# Altium project TIDA-010086_mod.PrjPcb (part 6 of 11)

## Sheet XTIDA-010086_ADC.SchDoc
size 558 x 431 mm; Date: Not shown in title block; ApprovedBy: Not shown in title block; CheckedBy: Not shown in title block; Author: Not shown in title block; CompanyName: Not shown in title block; Engineer: Not shown in title block; Organization: Not shown in title block; Address1: Not shown in title block; Address2: Not shown in title block; Address3: Not shown in title block; Address4: Not shown in title block; DocumentNumber: 2; Revision: Use project parameter SCH_Rev; SheetNumber: 5; SheetTotal: 8; PageSetup: Record=PageOptions|CenterHorizontal=True|CenterVertical=True|PrintScale=1.00|XCorrection=1.00|YCorrection=1.00|PrintKind=0|BorderSize=5000000|LeftOffset=0|BottomOffset=0|Orientation=2|PaperLength=1000|PaperWidth=1000|Scale=100|PaperSource=15|PrintQuality=600|MediaType=1|DitherType=10|PaperKind=Letter|PrintScaleMode=1; CurrentTime: Not shown in title block; CurrentDate: Not shown in title block; Time: Not shown in title block; DocumentFullPathAndName: Not shown in title block; DocumentName: Not shown in title block; ModifiedDate: Not shown in title block; ImagePath: Not shown in title block
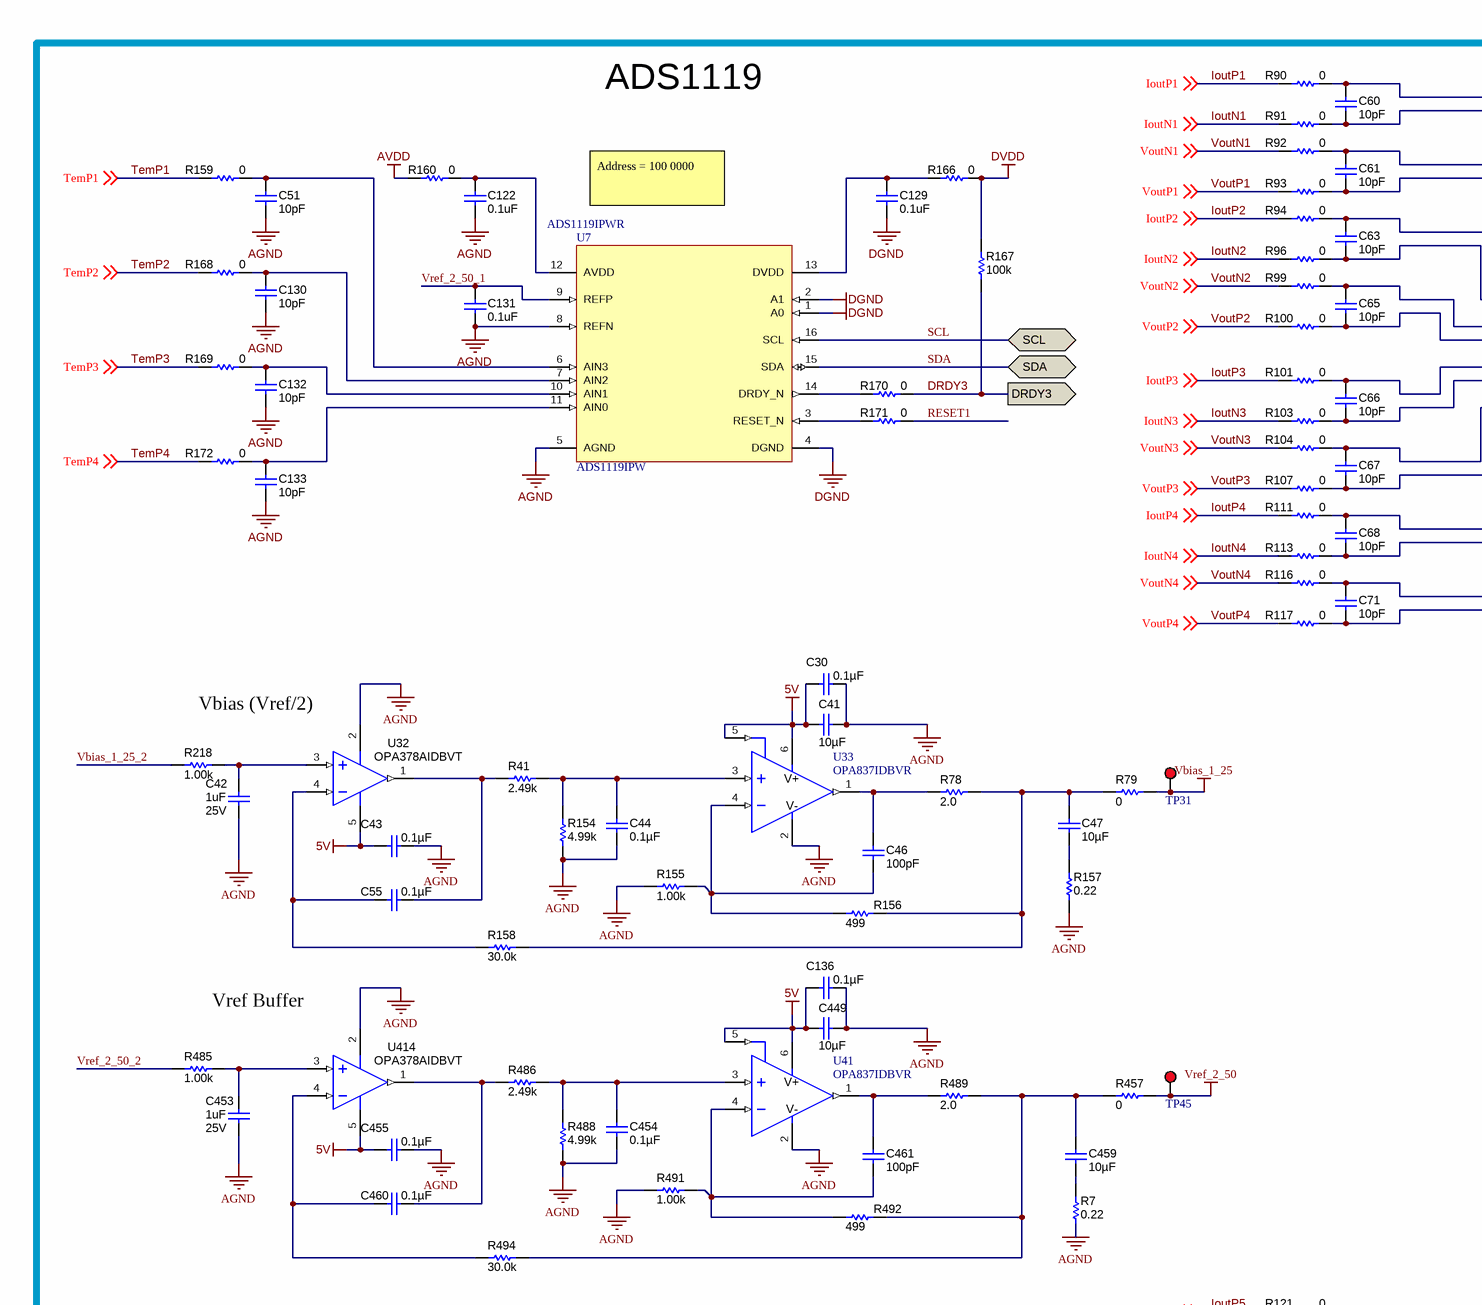
[diagram p9: XTIDA-010086_ADC.SchDoc, top left]
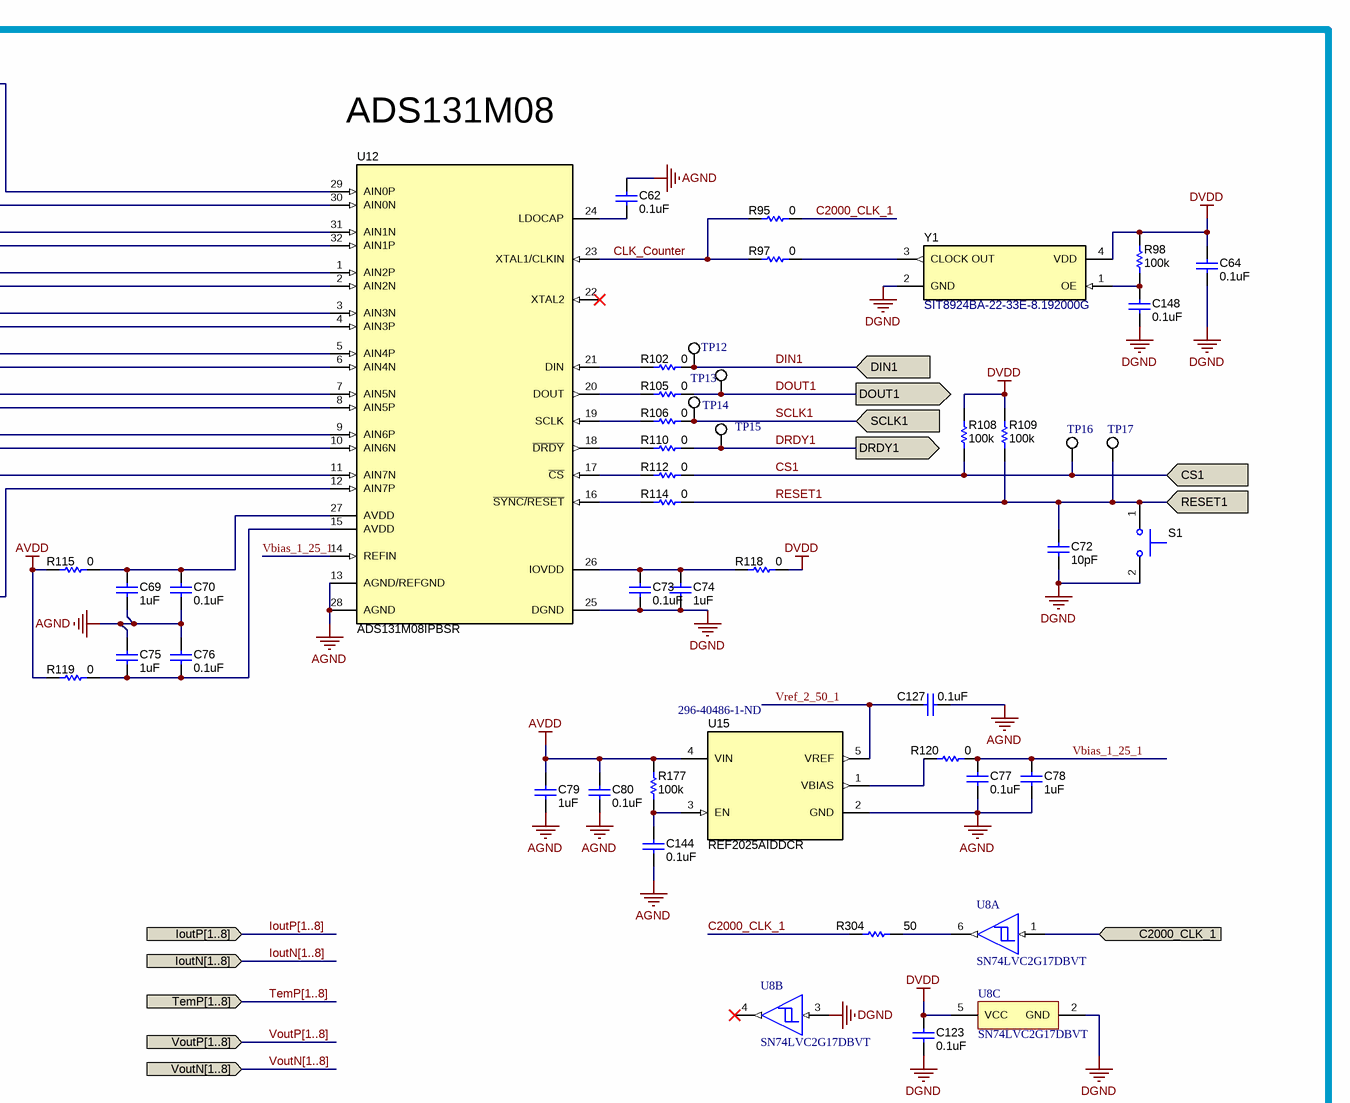
[diagram p10: XTIDA-010086_ADC.SchDoc, top right]
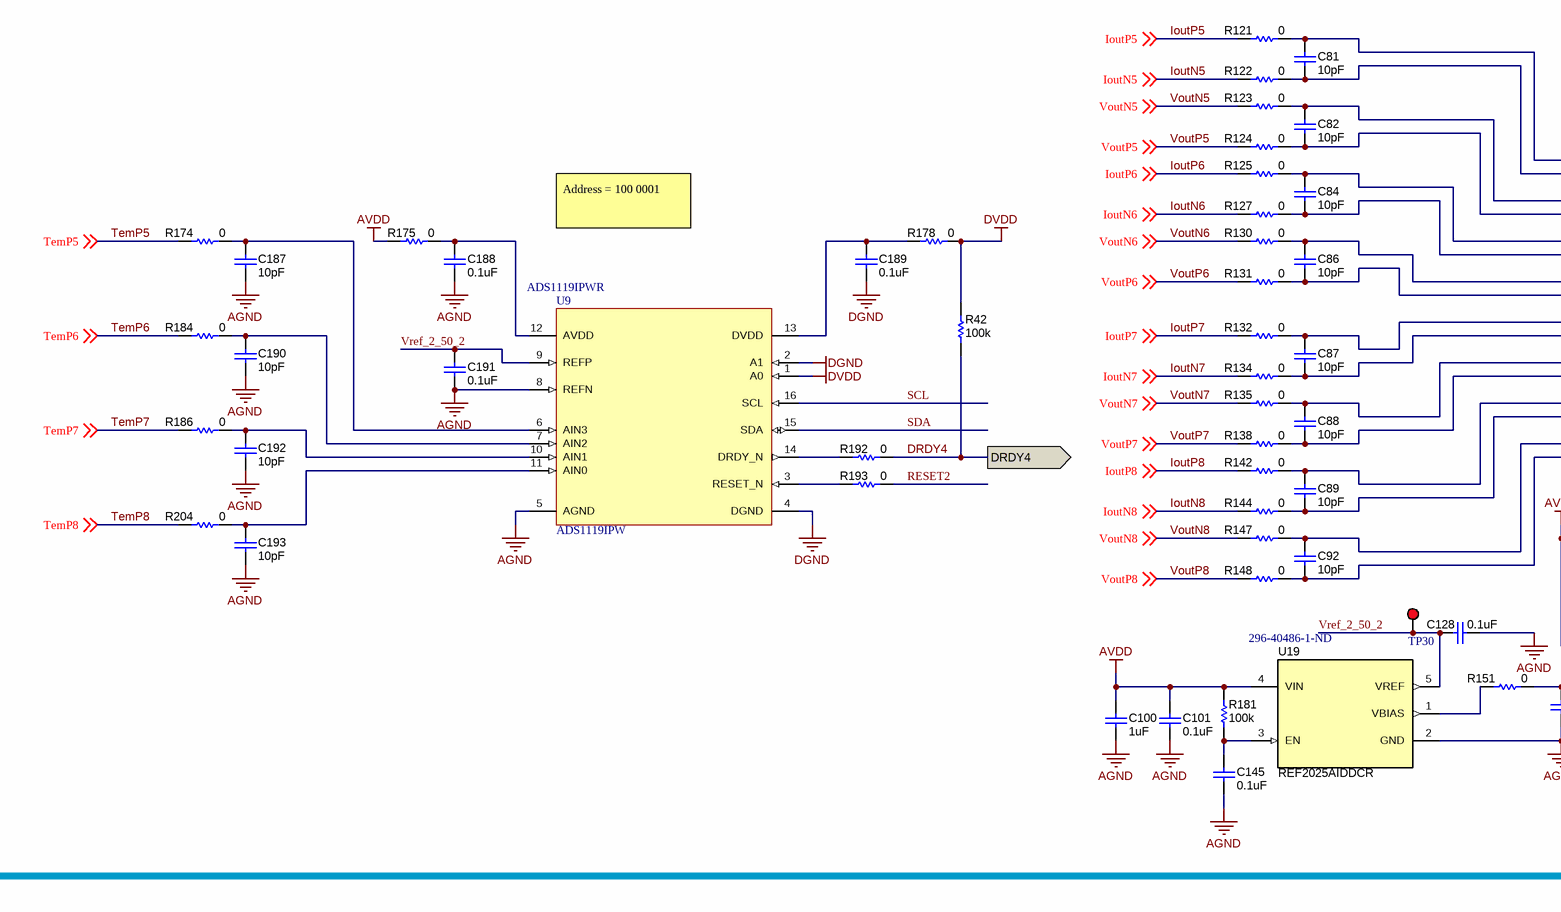
[diagram p11: XTIDA-010086_ADC.SchDoc, bottom left]
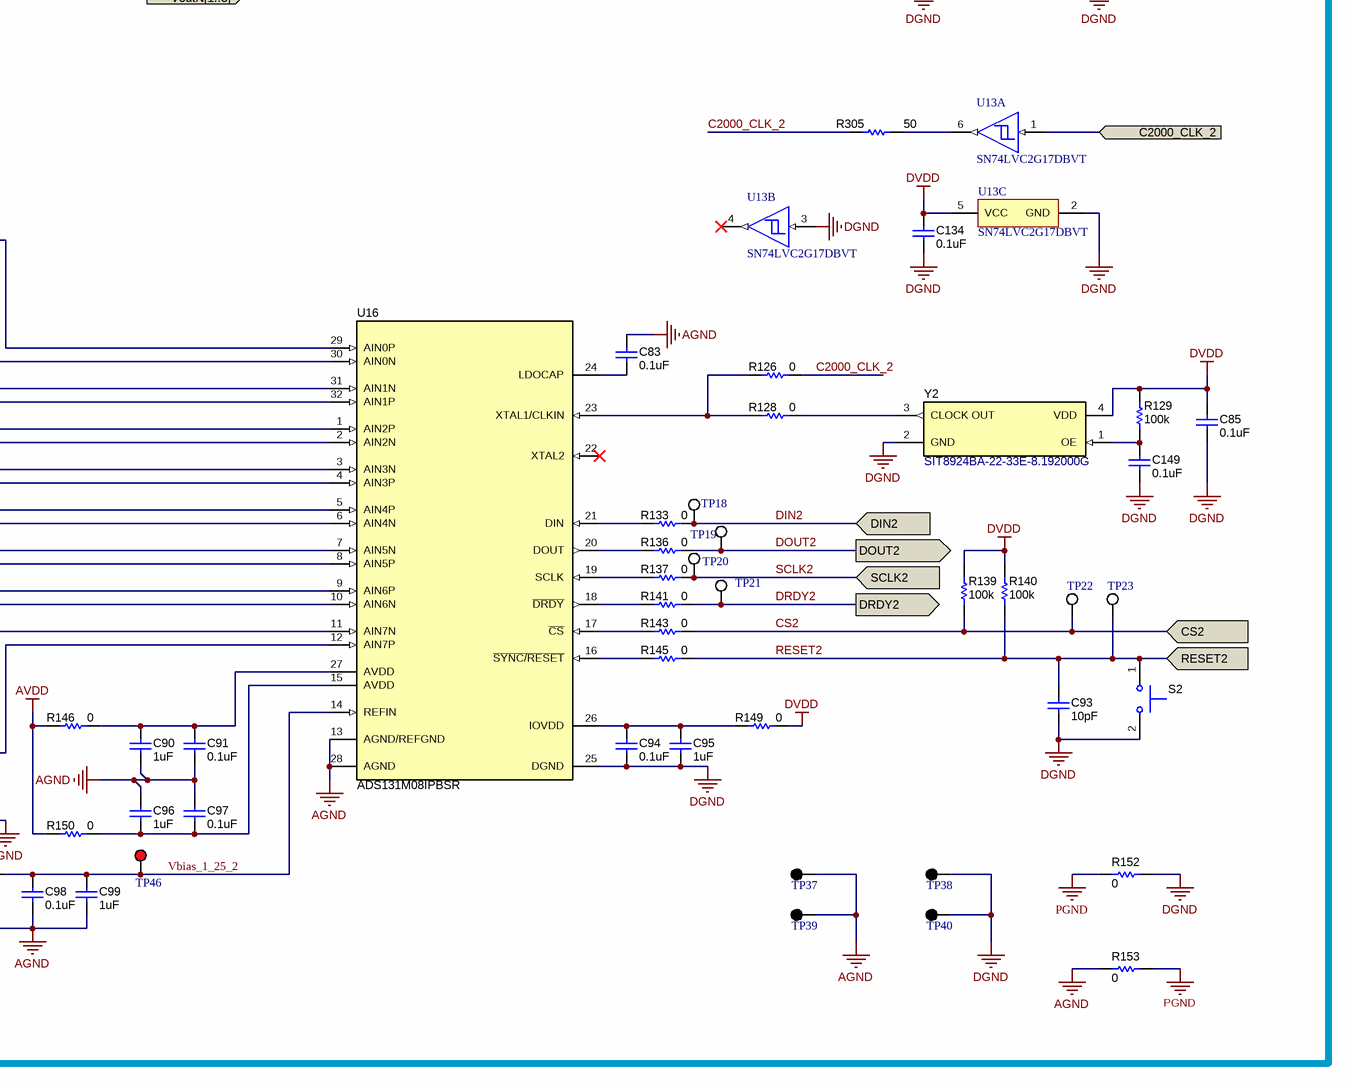
[diagram p12: XTIDA-010086_ADC.SchDoc, bottom right]

### Parts
C30  ValueDisplayed: 0.1µF  [0603]  (hidden comment: C0603C104J3RACTU)
C41  ValueDisplayed: 10µF  [0603L]  (hidden comment: ZRB18AD71A106KE01L)
C42  ValueDisplayed: 1uF  VDC_V: 25V  [0603]  (hidden comment: GRM188R71E105KA12D)
C43  ValueDisplayed: 0.1µF  [0603]  (hidden comment: C0603C104J3RACTU)
C44  ValueDisplayed: 0.1µF  [0603]  (hidden comment: C0603C104J3RACTU)
C46  ValueDisplayed: 100pF  [0603]  (hidden comment: 06035A101JAT2A)
C47  ValueDisplayed: 10µF  [0603L]  (hidden comment: ZRB18AD71A106KE01L)
C51  ValueDisplayed: 10pF  [0402]  (hidden comment: CGA2B2C0G1H100D050BA)
C55  ValueDisplayed: 0.1µF  [0603]  (hidden comment: C0603C104J3RACTU)
C60  ValueDisplayed: 10pF  [0402]  (hidden comment: CGA2B2C0G1H100D050BA)
C61  ValueDisplayed: 10pF  [0402]  (hidden comment: CGA2B2C0G1H100D050BA)
C62  ValueDisplayed: 0.1uF  [0603]  (hidden comment: 06033C104JAT2A)
C63  ValueDisplayed: 10pF  [0402]  (hidden comment: CGA2B2C0G1H100D050BA)
C64  ValueDisplayed: 0.1uF  [0603]  (hidden comment: 06033C104JAT2A)
C65  ValueDisplayed: 10pF  [0402]  (hidden comment: CGA2B2C0G1H100D050BA)
C66  ValueDisplayed: 10pF  [0402]  (hidden comment: CGA2B2C0G1H100D050BA)
C67  ValueDisplayed: 10pF  [0402]  (hidden comment: CGA2B2C0G1H100D050BA)
C68  ValueDisplayed: 10pF  [0402]  (hidden comment: CGA2B2C0G1H100D050BA)
C69  ValueDisplayed: 1uF  [0603]  (hidden comment: GRM188R71E105KA12D)
C70  ValueDisplayed: 0.1uF  [0603]  (hidden comment: 06033C104JAT2A)
C71  ValueDisplayed: 10pF  [0402]  (hidden comment: CGA2B2C0G1H100D050BA)
C72  ValueDisplayed: 10pF  [0603]  (hidden comment: 06035A100JAT2A)
C73  ValueDisplayed: 0.1uF  [0603]  (hidden comment: 06033C104JAT2A)
C74  ValueDisplayed: 1uF  [0603]  (hidden comment: GRM188R71E105KA12D)
C75  ValueDisplayed: 1uF  [0603]  (hidden comment: GRM188R71E105KA12D)
C76  ValueDisplayed: 0.1uF  [0603]  (hidden comment: 06033C104JAT2A)
C77  ValueDisplayed: 0.1uF  [0603]  (hidden comment: 06033C104JAT2A)
C78  ValueDisplayed: 1uF  [0603]  (hidden comment: GRM188R71E105KA12D)
C79  ValueDisplayed: 1uF  [0603]  (hidden comment: GRM188R71E105KA12D)
C80  ValueDisplayed: 0.1uF  [0603]  (hidden comment: 06033C104JAT2A)
C81  ValueDisplayed: 10pF  [0402]  (hidden comment: CGA2B2C0G1H100D050BA)
C82  ValueDisplayed: 10pF  [0402]  (hidden comment: CGA2B2C0G1H100D050BA)
C83  ValueDisplayed: 0.1uF  [0603]  (hidden comment: 06033C104JAT2A)
C84  ValueDisplayed: 10pF  [0402]  (hidden comment: CGA2B2C0G1H100D050BA)
C85  ValueDisplayed: 0.1uF  [0603]  (hidden comment: 06033C104JAT2A)
C86  ValueDisplayed: 10pF  [0402]  (hidden comment: CGA2B2C0G1H100D050BA)
C87  ValueDisplayed: 10pF  [0402]  (hidden comment: CGA2B2C0G1H100D050BA)
C88  ValueDisplayed: 10pF  [0402]  (hidden comment: CGA2B2C0G1H100D050BA)
C89  ValueDisplayed: 10pF  [0402]  (hidden comment: CGA2B2C0G1H100D050BA)
C90  ValueDisplayed: 1uF  [0603]  (hidden comment: GRM188R71E105KA12D)
C91  ValueDisplayed: 0.1uF  [0603]  (hidden comment: 06033C104JAT2A)
C92  ValueDisplayed: 10pF  [0402]  (hidden comment: CGA2B2C0G1H100D050BA)
C93  ValueDisplayed: 10pF  [0603]  (hidden comment: 06035A100JAT2A)
C94  ValueDisplayed: 0.1uF  [0603]  (hidden comment: 06033C104JAT2A)
C95  ValueDisplayed: 1uF  [0603]  (hidden comment: GRM188R71E105KA12D)
C96  ValueDisplayed: 1uF  [0603]  (hidden comment: GRM188R71E105KA12D)
C97  ValueDisplayed: 0.1uF  [0603]  (hidden comment: 06033C104JAT2A)
C98  ValueDisplayed: 0.1uF  [0603]  (hidden comment: 06033C104JAT2A)
C99  ValueDisplayed: 1uF  [0603]  (hidden comment: GRM188R71E105KA12D)
C100  ValueDisplayed: 1uF  [0603]  (hidden comment: GRM188R71E105KA12D)
C101  ValueDisplayed: 0.1uF  [0603]  (hidden comment: 06033C104JAT2A)
C122  ValueDisplayed: 0.1uF  [0603]  (hidden comment: 06033C104JAT2A)
C123  ValueDisplayed: 0.1uF  [0603]  (hidden comment: 06033C104JAT2A)
C127  ValueDisplayed: 0.1uF  [0603]  (hidden comment: 06033C104JAT2A)
C128  ValueDisplayed: 0.1uF  [0603]  (hidden comment: 06033C104JAT2A)
C129  ValueDisplayed: 0.1uF  [0603]  (hidden comment: 06033C104JAT2A)
C130  ValueDisplayed: 10pF  [0402]  (hidden comment: CGA2B2C0G1H100D050BA)
C131  ValueDisplayed: 0.1uF  [0603]  (hidden comment: 06033C104JAT2A)
C132  ValueDisplayed: 10pF  [0402]  (hidden comment: CGA2B2C0G1H100D050BA)
C133  ValueDisplayed: 10pF  [0402]  (hidden comment: CGA2B2C0G1H100D050BA)
C134  ValueDisplayed: 0.1uF  [0603]  (hidden comment: 06033C104JAT2A)
C136  ValueDisplayed: 0.1µF  [0603]  (hidden comment: C0603C104J3RACTU)
C144  ValueDisplayed: 0.1uF  [0603]  (hidden comment: 06033C104JAT2A)
C145  ValueDisplayed: 0.1uF  [0603]  (hidden comment: 06033C104JAT2A)
C148  ValueDisplayed: 0.1uF  [0603]  (hidden comment: 06033C104JAT2A)
C149  ValueDisplayed: 0.1uF  [0603]  (hidden comment: 06033C104JAT2A)
C187  ValueDisplayed: 10pF  [0402]  (hidden comment: CGA2B2C0G1H100D050BA)
C188  ValueDisplayed: 0.1uF  [0603]  (hidden comment: 06033C104JAT2A)
C189  ValueDisplayed: 0.1uF  [0603]  (hidden comment: 06033C104JAT2A)
C190  ValueDisplayed: 10pF  [0402]  (hidden comment: CGA2B2C0G1H100D050BA)
C191  ValueDisplayed: 0.1uF  [0603]  (hidden comment: 06033C104JAT2A)
C192  ValueDisplayed: 10pF  [0402]  (hidden comment: CGA2B2C0G1H100D050BA)
C193  ValueDisplayed: 10pF  [0402]  (hidden comment: CGA2B2C0G1H100D050BA)
C449  ValueDisplayed: 10µF  [0603L]  (hidden comment: ZRB18AD71A106KE01L)
C453  ValueDisplayed: 1uF  VDC_V: 25V  [0603]  (hidden comment: GRM188R71E105KA12D)
C454  ValueDisplayed: 0.1µF  [0603]  (hidden comment: C0603C104J3RACTU)
C455  ValueDisplayed: 0.1µF  [0603]  (hidden comment: C0603C104J3RACTU)
C459  ValueDisplayed: 10µF  [0603L]  (hidden comment: ZRB18AD71A106KE01L)
C460  ValueDisplayed: 0.1µF  [0603]  (hidden comment: C0603C104J3RACTU)
C461  ValueDisplayed: 100pF  [0603]  (hidden comment: 06035A101JAT2A)
R7  ValueDisplayed: 0.22  [0603]  (hidden comment: ERJ-3RQFR22V)
R41  ValueDisplayed: 2.49k  [0603]  (hidden comment: RG1608P-2491-B-T5)
R42  ValueDisplayed: 100k  [0603]  (hidden comment: RC0603FR-07100KL)
R78  ValueDisplayed: 2.0  [0603]  (hidden comment: CRCW06032R00JNEA)
R79  ValueDisplayed: 0  [0402]  (hidden comment: CRCW04020000Z0ED)
R90  ValueDisplayed: 0  [0402]  (hidden comment: CRCW04020000Z0ED)
R91  ValueDisplayed: 0  [0402]  (hidden comment: CRCW04020000Z0ED)
R92  ValueDisplayed: 0  [0402]  (hidden comment: CRCW04020000Z0ED)
R93  ValueDisplayed: 0  [0402]  (hidden comment: CRCW04020000Z0ED)
R94  ValueDisplayed: 0  [0402]  (hidden comment: CRCW04020000Z0ED)
R95  ValueDisplayed: 0  [0402]  (hidden comment: CRCW04020000Z0ED)
R96  ValueDisplayed: 0  [0402]  (hidden comment: CRCW04020000Z0ED)
R97  ValueDisplayed: 0  [0402]  (hidden comment: CRCW04020000Z0ED)
R98  ValueDisplayed: 100k  [0603]  (hidden comment: RC0603FR-07100KL)
R99  ValueDisplayed: 0  [0402]  (hidden comment: CRCW04020000Z0ED)
R100  ValueDisplayed: 0  [0402]  (hidden comment: CRCW04020000Z0ED)
R101  ValueDisplayed: 0  [0402]  (hidden comment: CRCW04020000Z0ED)
R102  ValueDisplayed: 0  [0402]  (hidden comment: CRCW04020000Z0ED)
R103  ValueDisplayed: 0  [0402]  (hidden comment: CRCW04020000Z0ED)
R104  ValueDisplayed: 0  [0402]  (hidden comment: CRCW04020000Z0ED)
R105  ValueDisplayed: 0  [0402]  (hidden comment: CRCW04020000Z0ED)
R106  ValueDisplayed: 0  [0402]  (hidden comment: CRCW04020000Z0ED)
R107  ValueDisplayed: 0  [0402]  (hidden comment: CRCW04020000Z0ED)
R108  ValueDisplayed: 100k  [0603]  (hidden comment: RC0603FR-07100KL)
R109  ValueDisplayed: 100k  [0603]  (hidden comment: RC0603FR-07100KL)
R110  ValueDisplayed: 0  [0402]  (hidden comment: CRCW04020000Z0ED)
R111  ValueDisplayed: 0  [0402]  (hidden comment: CRCW04020000Z0ED)
R112  ValueDisplayed: 0  [0402]  (hidden comment: CRCW04020000Z0ED)
R113  ValueDisplayed: 0  [0402]  (hidden comment: CRCW04020000Z0ED)
R114  ValueDisplayed: 0  [0402]  (hidden comment: CRCW04020000Z0ED)
R115  ValueDisplayed: 0  [0402]  (hidden comment: CRCW04020000Z0ED)
R116  ValueDisplayed: 0  [0402]  (hidden comment: CRCW04020000Z0ED)
R117  ValueDisplayed: 0  [0402]  (hidden comment: CRCW04020000Z0ED)
R118  ValueDisplayed: 0  [0402]  (hidden comment: CRCW04020000Z0ED)
R119  ValueDisplayed: 0  [0402]  (hidden comment: CRCW04020000Z0ED)
R120  ValueDisplayed: 0  [0402]  (hidden comment: CRCW04020000Z0ED)
R121  ValueDisplayed: 0  [0402]  (hidden comment: CRCW04020000Z0ED)
R122  ValueDisplayed: 0  [0402]  (hidden comment: CRCW04020000Z0ED)
R123  ValueDisplayed: 0  [0402]  (hidden comment: CRCW04020000Z0ED)
R124  ValueDisplayed: 0  [0402]  (hidden comment: CRCW04020000Z0ED)
R125  ValueDisplayed: 0  [0402]  (hidden comment: CRCW04020000Z0ED)
R126  ValueDisplayed: 0  [0402]  (hidden comment: CRCW04020000Z0ED)
R127  ValueDisplayed: 0  [0402]  (hidden comment: CRCW04020000Z0ED)
R128  ValueDisplayed: 0  [0402]  (hidden comment: CRCW04020000Z0ED)
R129  ValueDisplayed: 100k  [0603]  (hidden comment: RC0603FR-07100KL)
R130  ValueDisplayed: 0  [0402]  (hidden comment: CRCW04020000Z0ED)
R131  ValueDisplayed: 0  [0402]  (hidden comment: CRCW04020000Z0ED)
R132  ValueDisplayed: 0  [0402]  (hidden comment: CRCW04020000Z0ED)
R133  ValueDisplayed: 0  [0402]  (hidden comment: CRCW04020000Z0ED)
R134  ValueDisplayed: 0  [0402]  (hidden comment: CRCW04020000Z0ED)
R135  ValueDisplayed: 0  [0402]  (hidden comment: CRCW04020000Z0ED)
R136  ValueDisplayed: 0  [0402]  (hidden comment: CRCW04020000Z0ED)
R137  ValueDisplayed: 0  [0402]  (hidden comment: CRCW04020000Z0ED)
R138  ValueDisplayed: 0  [0402]  (hidden comment: CRCW04020000Z0ED)
R139  ValueDisplayed: 100k  [0603]  (hidden comment: RC0603FR-07100KL)
R140  ValueDisplayed: 100k  [0603]  (hidden comment: RC0603FR-07100KL)
R141  ValueDisplayed: 0  [0402]  (hidden comment: CRCW04020000Z0ED)
R142  ValueDisplayed: 0  [0402]  (hidden comment: CRCW04020000Z0ED)
R143  ValueDisplayed: 0  [0402]  (hidden comment: CRCW04020000Z0ED)
R144  ValueDisplayed: 0  [0402]  (hidden comment: CRCW04020000Z0ED)
R145  ValueDisplayed: 0  [0402]  (hidden comment: CRCW04020000Z0ED)
R146  ValueDisplayed: 0  [0402]  (hidden comment: CRCW04020000Z0ED)
R147  ValueDisplayed: 0  [0402]  (hidden comment: CRCW04020000Z0ED)
R148  ValueDisplayed: 0  [0402]  (hidden comment: CRCW04020000Z0ED)
R149  ValueDisplayed: 0  [0402]  (hidden comment: CRCW04020000Z0ED)
R150  ValueDisplayed: 0  [0402]  (hidden comment: CRCW04020000Z0ED)
R151  ValueDisplayed: 0  [0402]  (hidden comment: CRCW04020000Z0ED)
R152  ValueDisplayed: 0  [5108]  (hidden comment: 5108)
R153  ValueDisplayed: 0  [5108]  (hidden comment: 5108)
R154  ValueDisplayed: 4.99k  [0603]  (hidden comment: RG1608P-4991-B-T5)
R155  ValueDisplayed: 1.00k  [0603]  (hidden comment: RG1608P-102-B-T5)
R156  ValueDisplayed: 499  [0603]  (hidden comment: RG1608P-4990-B-T5)
R157  ValueDisplayed: 0.22  [0603]  (hidden comment: ERJ-3RQFR22V)
R158  ValueDisplayed: 30.0k  [0603]  (hidden comment: RG1608P-303-B-T5)
R159  ValueDisplayed: 0  [0402]  (hidden comment: CRCW04020000Z0ED)
R160  ValueDisplayed: 0  [0402]  (hidden comment: CRCW04020000Z0ED)
R166  ValueDisplayed: 0  [0402]  (hidden comment: CRCW04020000Z0ED)
R167  ValueDisplayed: 100k  [0603]  (hidden comment: RC0603FR-07100KL)
R168  ValueDisplayed: 0  [0402]  (hidden comment: CRCW04020000Z0ED)
R169  ValueDisplayed: 0  [0402]  (hidden comment: CRCW04020000Z0ED)
R170  ValueDisplayed: 0  [0402]  (hidden comment: CRCW04020000Z0ED)
R171  ValueDisplayed: 0  [0402]  (hidden comment: CRCW04020000Z0ED)
R172  ValueDisplayed: 0  [0402]  (hidden comment: CRCW04020000Z0ED)
R174  ValueDisplayed: 0  [0402]  (hidden comment: CRCW04020000Z0ED)
R175  ValueDisplayed: 0  [0402]  (hidden comment: CRCW04020000Z0ED)
R177  ValueDisplayed: 100k  [0603]  (hidden comment: RC0603FR-07100KL)
R178  ValueDisplayed: 0  [0402]  (hidden comment: CRCW04020000Z0ED)
R181  ValueDisplayed: 100k  [0603]  (hidden comment: RC0603FR-07100KL)
R184  ValueDisplayed: 0  [0402]  (hidden comment: CRCW04020000Z0ED)
R186  ValueDisplayed: 0  [0402]  (hidden comment: CRCW04020000Z0ED)
R192  ValueDisplayed: 0  [0402]  (hidden comment: CRCW04020000Z0ED)
R193  ValueDisplayed: 0  [0402]  (hidden comment: CRCW04020000Z0ED)
R204  ValueDisplayed: 0  [0402]  (hidden comment: CRCW04020000Z0ED)
R218  ValueDisplayed: 1.00k  [0603]  (hidden comment: RG1608P-102-B-T5)
R304  ValueDisplayed: 50  [0402]  (hidden comment: FC0402E50R0BST1)
R305  ValueDisplayed: 50  [0402]  (hidden comment: FC0402E50R0BST1)
R457  ValueDisplayed: 0  [0402]  (hidden comment: CRCW04020000Z0ED)
R485  ValueDisplayed: 1.00k  [0603]  (hidden comment: RG1608P-102-B-T5)
R486  ValueDisplayed: 2.49k  [0603]  (hidden comment: RG1608P-2491-B-T5)
R488  ValueDisplayed: 4.99k  [0603]  (hidden comment: RG1608P-4991-B-T5)
R489  ValueDisplayed: 2.0  [0603]  (hidden comment: CRCW06032R00JNEA)
R491  ValueDisplayed: 1.00k  [0603]  (hidden comment: RG1608P-102-B-T5)
R492  ValueDisplayed: 499  [0603]  (hidden comment: RG1608P-4990-B-T5)
R494  ValueDisplayed: 30.0k  [0603]  (hidden comment: RG1608P-303-B-T5)
S1  Switch_PushButton  [SW_TL1015AF160QG]  (value not drawn)
S2  Switch_PushButton  [SW_TL1015AF160QG]  (value not drawn)
TP12  5002  [Keystone5002]  (value not drawn)
TP13  5002  [Keystone5002]  (value not drawn)
TP14  5002  [Keystone5002]  (value not drawn)
TP15  5002  [Keystone5002]  (value not drawn)
TP16  5002  [Keystone5002]  (value not drawn)
TP17  5002  [Keystone5002]  (value not drawn)
TP18  5002  [Keystone5002]  (value not drawn)
TP19  5002  [Keystone5002]  (value not drawn)
TP20  5002  [Keystone5002]  (value not drawn)
TP21  5002  [Keystone5002]  (value not drawn)
TP22  5002  [Keystone5002]  (value not drawn)
TP23  5002  [Keystone5002]  (value not drawn)
TP30  5000  [Keystone5000]  (value not drawn)
TP31  5000  [Keystone5000]  (value not drawn)
TP37  5001  [Keystone5001]  (value not drawn)
TP38  5001  [Keystone5001]  (value not drawn)
TP39  5001  [Keystone5001]  (value not drawn)
TP40  5001  [Keystone5001]  (value not drawn)
TP45  5000  [Keystone5000]  (value not drawn)
TP46  5000  [Keystone5000]  (value not drawn)
U7  ADS1119IPW  Supplier Part Number 1: ADS1119IPWR  [PW0016A_M]
U8  SN74LVC2G17DBVT  [DBV0006A_N]  (parts A,B,C of 3)
U9  ADS1119IPW  Supplier Part Number 1: ADS1119IPWR  [PW0016A_M]
U12  ADS131M08IPBSR  [PBS0032A_N]
U13  SN74LVC2G17DBVT  [DBV0006A_N]  (parts A,B,C of 3)
U15  Supplier Part Number 1: 296-40486-1-ND  [DBV0005A_N]  (hidden comment: REF2025AIDDCR)
U16  ADS131M08IPBSR  [PBS0032A_N]
U19  Supplier Part Number 1: 296-40486-1-ND  [DBV0005A_N]  (hidden comment: REF2025AIDDCR)
U32  OPA378AIDBVT  [DBV0005A_N]
U33  OPA837IDBVR  [DBV6_TEX]
U41  OPA837IDBVR  [DBV6_TEX]
U414  OPA378AIDBVT  [DBV0005A_N]
Y1  SIT8924BA-22-33E-8.192000G  [SiTime_SiT8924B_2]
Y2  SIT8924BA-22-33E-8.192000G  [SiTime_SiT8924B_2]

### Ports
C2000_CLK_1 (in), C2000_CLK_2 (in), CS1 (in), CS2 (in), DIN1 (in), DIN2 (in), DOUT1 (out), DOUT2 (out), DRDY1 (out), DRDY2 (out), DRDY3 (out), DRDY4 (out), IoutN[1..8] (in), IoutP[1..8] (in), RESET1 (in), RESET2 (in), SCL (bidir), SCLK1 (in), SCLK2 (in), SDA (bidir), TemP[1..8] (in), VoutN[1..8] (in), VoutP[1..8] (in)

### Nets
5V: C30.2 C41.2 C43.2 C136.2 C449.2 C455.2 U32.5(V+) U33.5(MODE) U33.6(V+) U41.5(MODE) U41.6(V+) U414.5(V+)
AGND: C30.1 C41.1 C42.2 C43.1 C44.2 C51.2 C62.1 C69.2 C70.2 C75.1 C76.1 C77.2 C78.2 C79.2 C80.2 C83.1 C90.2 C91.2 C96.1 C97.1 C98.2 C99.2 C100.2 C101.2 C122.2 C127.1 C128.1 C130.2 C131.2 C132.2 C133.2 C136.1 C144.2 C145.2 C187.2 C188.2 C190.2 C191.2 C192.2 C193.2 C449.1 C453.2 C454.2 C455.1 R7.1 R153.1 R154.1 R155.1 R157.1 R488.1 R491.1 TP37.1 TP39.1 U7.5(AGND) U7.8(REFN) U9.5(AGND) U9.8(REFN) U12.13(AGND/REFGND) U12.28(AGND) U15.2(GND) U16.13(AGND/REFGND) U16.28(AGND) U19.2(GND) U32.2(V-) U33.2(V-) U41.2(V-) U414.2(V-)
AVDD: C79.1 C80.1 C100.1 C101.1 R115.1 R119.1 R146.1 R150.1 R160.1 R175.1 R177.2 R181.2 U15.4(VIN) U19.4(VIN)
DGND: C64.2 C72.1 C73.2 C74.2 C85.2 C93.1 C94.2 C95.2 C123.2 C129.2 C134.2 C148.2 C149.2 C189.2 R152.2 S1.2 S2.2 TP38.1 TP40.1 U7.1(A0) U7.2(A1) U7.4(DGND) U8.2(GND) U8.3(2A) U9.2(A1) U9.4(DGND) U12.25(DGND) U13.2(GND) U13.3(2A) U16.25(DGND) Y1.2(GND) Y2.2(GND)
DVDD: C64.1 C85.1 C123.1 C134.1 R42.2 R98.2 R108.2 R109.2 R118.2 R129.2 R139.2 R140.2 R149.2 R166.2 R167.2 R178.2 U8.5(VCC) U9.1(A0) U13.5(VCC) Y1.4(VDD) Y2.4(VDD)
PGND: R152.1 R153.2
Vbias_1_25: R79.2 TP31.1
Vref_2_50: R457.2 TP45.1
C2000_CLK_1: R95.2 R304.2
C2000_CLK_1: U8.1(1A) ; port C2000_CLK_1  [a separate net that carries the same name]
C2000_CLK_2: R126.2 R305.2
C2000_CLK_2: U13.1(1A) ; port C2000_CLK_2  [a separate net that carries the same name]
CLK_Counter: R95.1 R97.1 U12.23(XTAL1/CLKIN)
CS1: R108.1 R112.2 TP16.1 ; port CS1
CS2: R139.1 R143.2 TP22.1 ; port CS2
DIN1: R102.2 TP12.1 ; port DIN1
DIN2: R133.2 TP18.1 ; port DIN2
DOUT1: R105.2 TP13.1 ; port DOUT1
DOUT2: R136.2 TP19.1 ; port DOUT2
DRDY1: R110.2 TP15.1 ; port DRDY1
DRDY2: R141.2 TP21.1 ; port DRDY2
DRDY3: R167.1 R170.2 ; port DRDY3
DRDY4: R42.1 R192.2 ; port DRDY4
IoutN1: R91.1 ; off-sheet IoutN1
IoutN2: R96.1 ; off-sheet IoutN2
IoutN3: R103.1 ; off-sheet IoutN3
IoutN4: R113.1 ; off-sheet IoutN4
IoutN5: R122.1 ; off-sheet IoutN5
IoutN6: R127.1 ; off-sheet IoutN6
IoutN7: R134.1 ; off-sheet IoutN7
IoutN8: R144.1 ; off-sheet IoutN8
IoutP1: R90.1 ; off-sheet IoutP1
IoutP2: R94.1 ; off-sheet IoutP2
IoutP3: R101.1 ; off-sheet IoutP3
IoutP4: R111.1 ; off-sheet IoutP4
IoutP5: R121.1 ; off-sheet IoutP5
IoutP6: R125.1 ; off-sheet IoutP6
IoutP7: R132.1 ; off-sheet IoutP7
IoutP8: R142.1 ; off-sheet IoutP8
RESET1: C72.2 R109.1 R114.2 R171.2 S1.1 TP17.1 ; port RESET1
RESET2: C93.2 R140.1 R145.2 R193.2 S2.1 TP23.1 ; port RESET2
SCL: U7.16(SCL) U9.16(SCL) ; port SCL
SCLK1: R106.2 TP14.1 ; port SCLK1
SCLK2: R137.2 TP20.1 ; port SCLK2
SDA: U7.15(SDA) U9.15(SDA) ; port SDA
TemP1: R159.1 ; off-sheet TemP1
TemP2: R168.1 ; off-sheet TemP2
TemP3: R169.1 ; off-sheet TemP3
TemP4: R172.1 ; off-sheet TemP4
TemP5: R174.1 ; off-sheet TemP5
TemP6: R184.1 ; off-sheet TemP6
TemP7: R186.1 ; off-sheet TemP7
TemP8: R204.1 ; off-sheet TemP8
Vbias_1_25_1: C77.1 C78.1 R120.2 U12.14(REFIN)
Vbias_1_25_2: C98.1 C99.1 R151.2 R218.1 TP46.1 U16.14(REFIN)
VoutN1: R92.1 ; off-sheet VoutN1
VoutN2: R99.1 ; off-sheet VoutN2
VoutN3: R104.1 ; off-sheet VoutN3
VoutN4: R116.1 ; off-sheet VoutN4
VoutN5: R123.1 ; off-sheet VoutN5
VoutN6: R130.1 ; off-sheet VoutN6
VoutN7: R135.1 ; off-sheet VoutN7
VoutN8: R147.1 ; off-sheet VoutN8
VoutP1: R93.1 ; off-sheet VoutP1
VoutP2: R100.1 ; off-sheet VoutP2
VoutP3: R107.1 ; off-sheet VoutP3
VoutP4: R117.1 ; off-sheet VoutP4
VoutP5: R124.1 ; off-sheet VoutP5
VoutP6: R131.1 ; off-sheet VoutP6
VoutP7: R138.1 ; off-sheet VoutP7
VoutP8: R148.1 ; off-sheet VoutP8
Vref_2_50_1: C127.2 C131.1 U7.9(REFP) U15.5(VREF)
Vref_2_50_2: C128.2 C191.1 R485.1 TP30.1 U9.9(REFP) U19.5(VREF)
NetC42_1: C42.1 R218.2 U32.3(IN+)
NetC44_1: C44.1 R41.2 R154.2 U33.3(IN+)
NetC46_1: C46.1 R78.1 U33.1(OUT)
NetC46_2: C46.2 R155.2 R156.1 U33.4(IN-)
NetC47_1: C47.1 R78.2 R79.1 R156.2 R158.2
NetC47_2: C47.2 R157.2
NetC51_1: C51.1 R159.2 U7.6(AIN3)
NetC55_1: C55.1 R41.1 U32.1(OUT)
NetC55_2: C55.2 R158.1 U32.4(IN-)
NetC60_1: C60.1 R90.2 U12.29(AIN0P)
NetC60_2: C60.2 R91.2 U12.30(AIN0N)
NetC61_1: C61.1 R92.2 U12.31(AIN1N)
NetC61_2: C61.2 R93.2 U12.32(AIN1P)
NetC62_2: C62.2 U12.24(LDOCAP)
NetC63_1: C63.1 R94.2 U12.1(AIN2P)
NetC63_2: C63.2 R96.2 U12.2(AIN2N)
NetC65_1: C65.1 R99.2 U12.3(AIN3N)
NetC65_2: C65.2 R100.2 U12.4(AIN3P)
NetC66_1: C66.1 R101.2 U12.5(AIN4P)
NetC66_2: C66.2 R103.2 U12.6(AIN4N)
NetC67_1: C67.1 R104.2 U12.7(AIN5N)
NetC67_2: C67.2 R107.2 U12.8(AIN5P)
NetC68_1: C68.1 R111.2 U12.9(AIN6P)
NetC68_2: C68.2 R113.2 U12.10(AIN6N)
NetC69_1: C69.1 C70.1 R115.2 U12.27(AVDD)
NetC71_1: C71.1 R116.2 U12.11(AIN7N)
NetC71_2: C71.2 R117.2 U12.12(AIN7P)
NetC73_1: C73.1 C74.1 R118.1 U12.26(IOVDD)
NetC75_2: C75.2 C76.2 R119.2 U12.15(AVDD)
NetC81_1: C81.1 R121.2 U16.29(AIN0P)
NetC81_2: C81.2 R122.2 U16.30(AIN0N)
NetC82_1: C82.1 R123.2 U16.31(AIN1N)
NetC82_2: C82.2 R124.2 U16.32(AIN1P)
NetC83_2: C83.2 U16.24(LDOCAP)
NetC84_1: C84.1 R125.2 U16.1(AIN2P)
NetC84_2: C84.2 R127.2 U16.2(AIN2N)
NetC86_1: C86.1 R130.2 U16.3(AIN3N)
NetC86_2: C86.2 R131.2 U16.4(AIN3P)
NetC87_1: C87.1 R132.2 U16.5(AIN4P)
NetC87_2: C87.2 R134.2 U16.6(AIN4N)
NetC88_1: C88.1 R135.2 U16.7(AIN5N)
NetC88_2: C88.2 R138.2 U16.8(AIN5P)
NetC89_1: C89.1 R142.2 U16.9(AIN6P)
NetC89_2: C89.2 R144.2 U16.10(AIN6N)
NetC90_1: C90.1 C91.1 R146.2 U16.27(AVDD)
NetC92_1: C92.1 R147.2 U16.11(AIN7N)
NetC92_2: C92.2 R148.2 U16.12(AIN7P)
NetC94_1: C94.1 C95.1 R149.1 U16.26(IOVDD)
NetC96_2: C96.2 C97.2 R150.2 U16.15(AVDD)
NetC122_1: C122.1 R160.2 U7.12(AVDD)
NetC129_1: C129.1 R166.1 U7.13(DVDD)
NetC130_1: C130.1 R168.2 U7.7(AIN2)
NetC132_1: C132.1 R169.2 U7.10(AIN1)
NetC133_1: C133.1 R172.2 U7.11(AIN0)
NetC144_1: C144.1 R177.1 U15.3(EN)
NetC145_1: C145.1 R181.1 U19.3(EN)
NetC148_1: C148.1 R98.1 Y1.1(OE)
NetC149_1: C149.1 R129.1 Y2.1(OE)
NetC187_1: C187.1 R174.2 U9.6(AIN3)
NetC188_1: C188.1 R175.2 U9.12(AVDD)
NetC189_1: C189.1 R178.1 U9.13(DVDD)
NetC190_1: C190.1 R184.2 U9.7(AIN2)
NetC192_1: C192.1 R186.2 U9.10(AIN1)
NetC193_1: C193.1 R204.2 U9.11(AIN0)
NetC453_1: C453.1 R485.2 U414.3(IN+)
NetC454_1: C454.1 R486.2 R488.2 U41.3(IN+)
NetC459_1: C459.1 R457.1 R489.2 R492.2 R494.2
NetC459_2: C459.2 R7.2
NetC460_1: C460.1 R486.1 U414.1(OUT)
NetC460_2: C460.2 R494.1 U414.4(IN-)
NetC461_1: C461.1 R489.1 U41.1(OUT)
NetC461_2: C461.2 R491.2 R492.1 U41.4(IN-)
NetR97_2: R97.2 Y1.3(CLOCK_OUT)
NetR102_1: R102.1 U12.21(DIN)
NetR105_1: R105.1 U12.20(DOUT)
NetR106_1: R106.1 U12.19(SCLK)
NetR110_1: R110.1 U12.18(~{DRDY})
NetR112_1: R112.1 U12.17(~{CS})
NetR114_1: R114.1 U12.16(~{SYNC/RESET})
NetR120_1: R120.1 U15.1(VBIAS)
NetR126_1: R126.1 R128.1 U16.23(XTAL1/CLKIN)
NetR128_2: R128.2 Y2.3(CLOCK_OUT)
NetR133_1: R133.1 U16.21(DIN)
NetR136_1: R136.1 U16.20(DOUT)
NetR137_1: R137.1 U16.19(SCLK)
NetR141_1: R141.1 U16.18(~{DRDY})
NetR143_1: R143.1 U16.17(~{CS})
NetR145_1: R145.1 U16.16(~{SYNC/RESET})
NetR151_1: R151.1 U19.1(VBIAS)
NetR170_1: R170.1 U7.14(DRDY_N)
NetR171_1: R171.1 U7.3(RESET_N)
NetR192_1: R192.1 U9.14(DRDY_N)
NetR193_1: R193.1 U9.3(RESET_N)
NetR304_1: R304.1 U8.6(1Y)
NetR305_1: R305.1 U13.6(1Y)

Not connected (* = marked no-connect by the designer): U8 4(2Y)*; U12 22(XTAL2)*; U13 4(2Y)*; U16 22(XTAL2)*

### Buses and harness runs
bus IoutN[1..8] = port IoutN[1..8]
bus IoutP[1..8] = port IoutP[1..8]
bus TemP[1..8] = port TemP[1..8]
bus VoutN[1..8] = port VoutN[1..8]
bus VoutP[1..8] = port VoutP[1..8]

### Notes on the sheet
- ADS1119
- ADS131M08
- Address = 100 0000
- Vbias (Vref/2)
- Vref Buffer
- Address = 100 0001
- Drawn By:
- SVN Rev:
- Number:
- TID #:
- Orderable:
- Rev:
- Sheet Title:
- File:
- Project Title:
- Designed for:
- Assembly Variant:
- Mod. Date:
- Sheet:
- Size:
- of
- C
- http://www.ti.com
- Texas Instruments and/or its licensors do not warrant the accuracy or completeness of this specification or any information contained therein. Texas Instruments and/or its licensors do not warrant that this design will meet the specifications, will be suitable for your application or fit for any particular purpose, or will operate in an implementation. Texas Instruments and/or its licensors do not warrant that the design is production worthy. You should completely validate and test your design implementation to confirm the system functionality for your application.
- Engineer:
- Contact:
- © Texas Instruments